# EAGLE design dsky_md_4.0v (EAGLE 6.5.0)
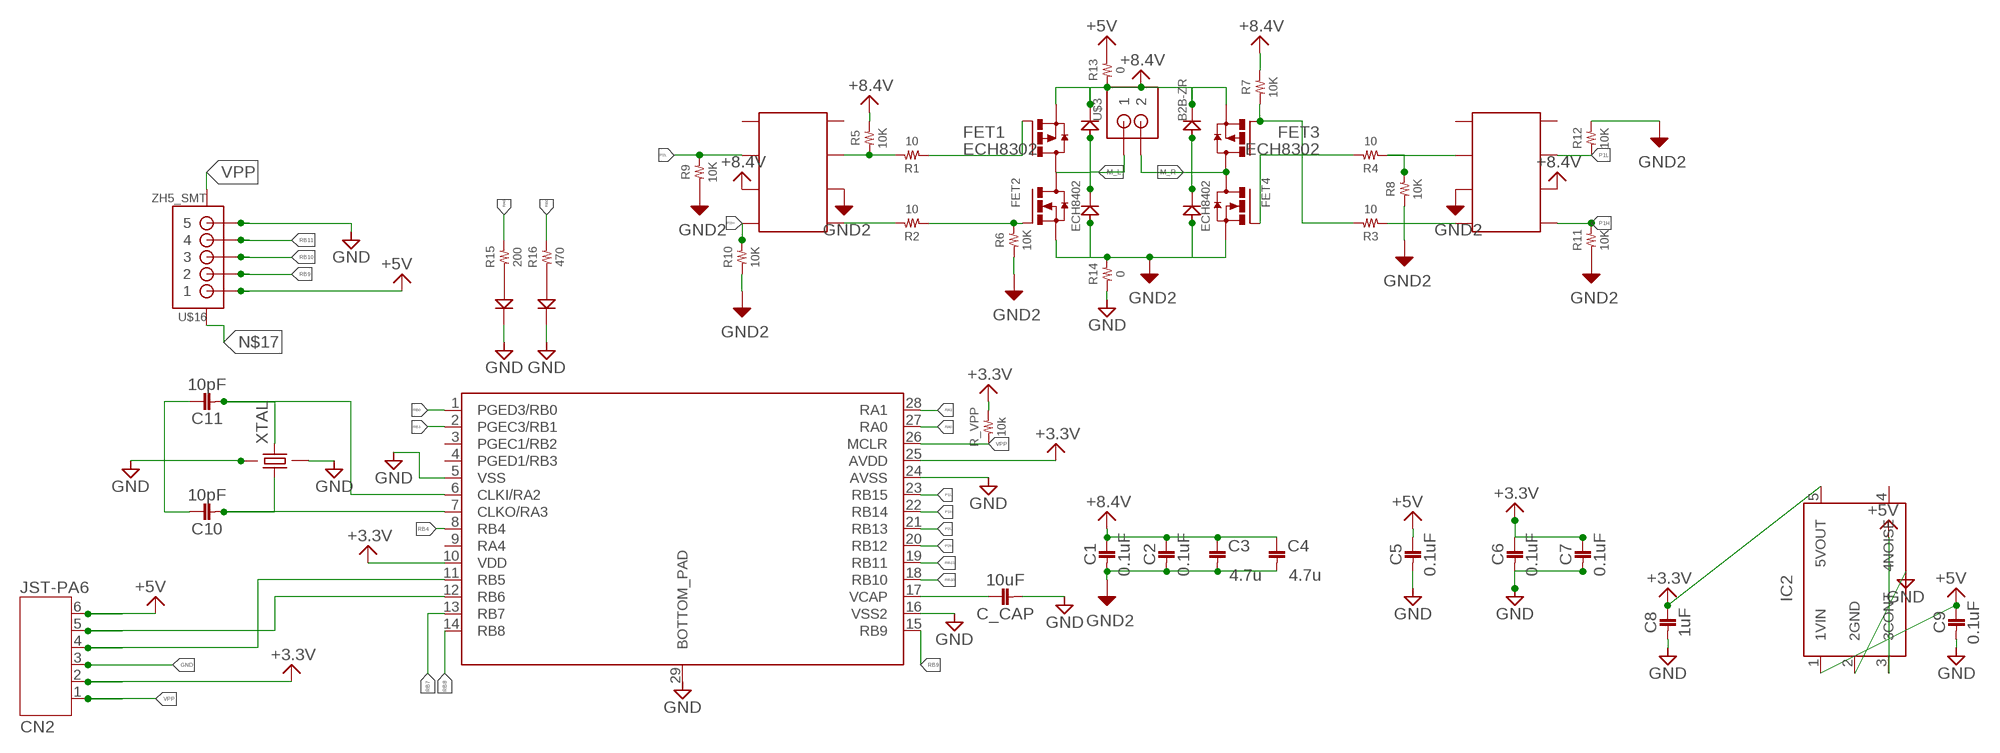
[diagram p0: schematic, sheet 1]

## Parts
C1  0.1uF  1608  [1608]
C2  0.1uF  1608  [1608]
C3  4.7u  2012  [2012]
C4  4.7u  2012  [2012]
C5  0.1uF  1608  [1608]
C6  0.1uF  1608  [1608]
C7  0.1uF  1608  [1608]
C8  1uF  1608  [1608]
C9  0.1uF  1608  [1608]
C10  10pF  1608  [1608]
C11  10pF  1608  [1608]
C_CAP  10uF  1608  [1608]
CN2  JST-PA6  [JST-PA6]
D1  SS2040  [SOD-123FL]
D2  SS2040  [SOD-123FL]
D3  SS2040  [SOD-123FL]
D4  SS2040  [SOD-123FL]
FET1  ECH8302  ECH83  [ECH8]
FET2  ECH8402  ECH84  [ECH8]
FET3  ECH8302  ECH83  [ECH8]
FET4  ECH8402  ECH84  [ECH8]
IC1  DSPIC33EP32MC202  [QFN-S28_6X6MC]
IC2  NJM2866F33  TAR5SB  [SSOP5-P-0.95]
IC3  TC1427COA  [SOIC8]
IC4  TC1427COA  [SOIC8]
LED1  1608  [1608]
LED2  1608  [1608]
R1  10  RESISTOR__SMD  [1608]
R2  10  RESISTOR__SMD  [1608]
R3  10  RESISTOR__SMD  [1608]
R4  10  RESISTOR__SMD  [1608]
R5  10K  RESISTOR__SMD  [1608]
R6  10K  RESISTOR__SMD  [1608]
R7  10K  RESISTOR__SMD  [1608]
R8  10K  RESISTOR__SMD  [1608]
R9  10K  RESISTOR__SMD  [1608]
R10  10K  RESISTOR__SMD  [1608]
R11  10K  RESISTOR__SMD  [1608]
R12  10K  RESISTOR__SMD  [1608]
R13  0  RESISTOR__SMD  [1608]
R14  0  RESISTOR__SMD  [1608]
R15  200  RESISTOR__SMD  [1608]
R16  470  RESISTOR__SMD  [1608]
R_VPP  10k  RESISTOR__SMD  [1608]
U$3  B2B-ZR  [B2B-ZR]
U$16  ZH5_SMT  [ZH5_SMT]
XTAL  X22  [SMD_X22]

## Nets
+3.3V: C6.P$1 C7.P$1 C8.P$1 CN2.2 IC1.10(VDD) IC1.25(AVDD) IC2.5(5VOUT) R_VPP.2
+5V: C5.P$1 C9.P$1 CN2.6 IC2.1(1VIN) IC2.3(3CONT) R13.2 U$16.P1
+8.4V: C1.P$1 C2.P$1 C3.1 C4.1 D1.2(PK) D3.2(PK) FET1.1(S) FET1.2(S) FET1.3(S) FET3.1(S) FET3.2(S) FET3.3(S) IC3.3(3_GND) IC4.3(3_GND) R5.2 R7.2 R13.1
GND: C5.P$2 C6.P$2 C7.P$2 C8.P$2 C9.P$2 C10.P$1 C11.P$1 C_CAP.P$2 CN2.3 IC1.5(VSS) IC1.16(VSS2) IC1.24(AVSS) IC1.29(BOTTOM_PAD) IC2.2(2GND) LED1.2(K) LED2.2(K) R14.1 U$16.P5 XTAL.2 XTAL.4
GND2: C1.P$2 C2.P$2 C3.2 C4.2 D2.1(PA) D4.1(PA) FET2.1(S) FET2.2(S) FET2.3(S) FET4.1(S) FET4.2(S) FET4.3(S) IC3.6(6_VDD) IC4.6(6_VDD) R6.1 R8.1 R9.1 R10.1 R11.1 R12.2 R14.2
M_L: D1.1(PA) D2.2(PK) FET1.5(D) FET1.6(D) FET1.7(D) FET1.8(D) FET2.5(D) FET2.6(D) FET2.7(D) FET2.8(D) U$3.1
M_R: D3.1(PA) D4.2(PK) FET3.5(D) FET3.6(D) FET3.7(D) FET3.8(D) FET4.5(D) FET4.6(D) FET4.7(D) FET4.8(D) U$3.2
N$1: FET1.4(G) R1.1
N$2: FET2.4(G) R2.1 R6.2
N$3: IC3.7(7_OUT_A) R1.2 R5.1
N$4: FET3.4(G) R3.2 R7.1
N$5: IC3.5(5_OUT_B) R2.2
N$6: IC4.7(7_OUT_A) R4.1 R8.2
N$7: C_CAP.P$1 IC1.17(VCAP)
N$8: C10.P$2 IC1.7(CLKO/RA3) XTAL.1
N$9: IC4.5(5_OUT_B) R3.1
N$10: CN2.4 IC1.11(RB5)
N$11: CN2.5 IC1.12(RB6)
N$12: FET4.4(G) R4.2
N$13: C11.P$2 IC1.6(CLKI/RA2) XTAL.3
N$14: LED1.1(A) R15.1
N$16: LED2.1(A) R16.1
N$17: U$16.G1(G_L)
P1H: IC1.22(RB14) IC4.4(4_IN_B) R11.2
P1L: IC1.23(RB15) IC4.2(2_IN_A) R12.1
P2H: IC1.20(RB12) IC3.4(4_IN_B) R10.2
P2L: IC1.21(RB13) IC3.2(2_IN_A) R9.2
RA0: IC1.27(RA0) R15.2
RA1: IC1.28(RA1)
RB0: IC1.1(PGED3/RB0) R16.2
RB1: IC1.2(PGEC3/RB1)
RB4: IC1.8(RB4)
RB7: IC1.13(RB7)
RB8: IC1.14(RB8)
RB9: IC1.15(RB9) U$16.P2
RB10: IC1.18(RB10) U$16.P3
RB11: IC1.19(RB11) U$16.P4
VPP: CN2.1 IC1.26(MCLR) R_VPP.1 U$16.G2(G_R)
Unconnected: IC1.3(PGEC1/RB2) IC1.4(PGED1/RB3) IC1.9(RA4) IC2.4(4NOISE) IC3.1(1_NC) IC3.8(8_NC) IC4.1(1_NC) IC4.8(8_NC)

## Library data of the parts
C1 C2 C5-C11 C_CAP = 02_C:1608
C3 C4 = 02_C:2012
CN2 = jst-ph:JST-PA6
D1-D4 = DIODE:SS2040
FET1 FET3 = 06_FET:ECH83
FET2 FET4 = 06_FET:ECH84
IC1 = microchip-dspic:DSPIC33EP32MC202
IC2 = 04_IC:TAR5SB
IC3 IC4 = 04_IC:TC1427COA
LED1 LED2 = 10_LED:1608
R1-R16 R_VPP = 01_R:RESISTOR__SMD
U$3 = jst:B2B-ZR
U$16 = 14_JST:ZH5_SMT
XTAL = 09_2_CRYSTAL:X22

## Board
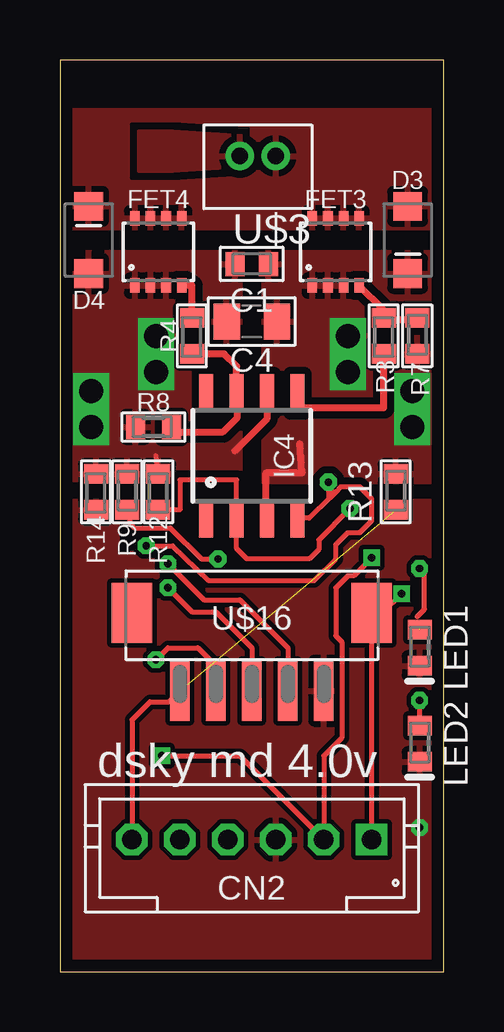
[diagram p1: board, top side]
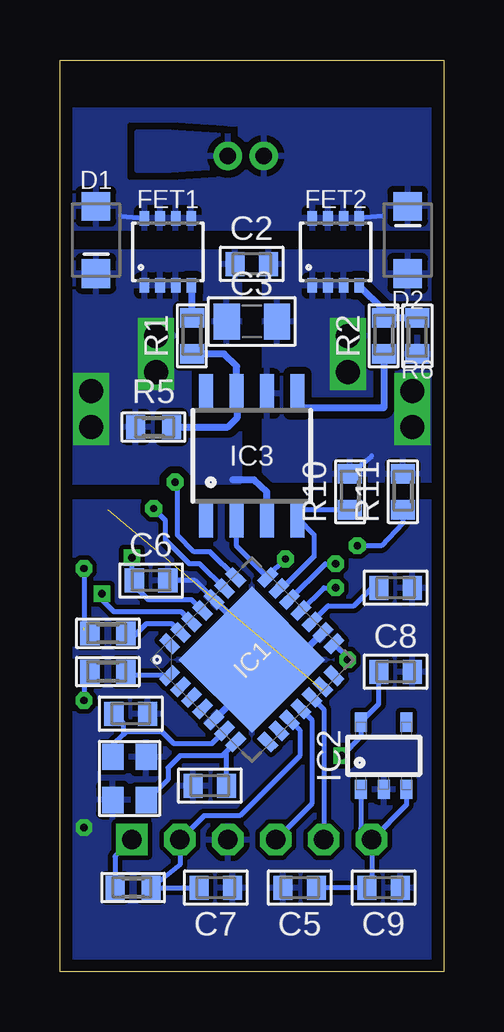
[diagram p2: board, bottom side, seen from below]

Size 16 x 38 mm. Coordinates in mm from the lower left corner, seen from the top.
Outline: 0,0 16,0 16,38 0,38 0,0
Copper layers (1*16): Top 0.035mm / dielectric 1.5mm / Bottom 0.035mm
Design rules "default *": minimum track width 6mil, minimum drill 12mil, track to track 6mil, track to pad 6mil, pad to pad 6mil, via to via 6mil, smd to smd 8mil, copper to edge 20mil, drill to drill 8mil, minimum pad ring 10mil, minimum via ring 8mil, stop-mask expansion 4mil, vias tented up to drill 0.4mm, thermal gap 10mil
bKeepout: area 0,0 to 16,2; area 0,36 to 16,38

### Footprints (pad centres in the part's own frame; a part is rotated, then mirrored left to right if it is on the bottom)
1608 = smd 0.8 x 1: P$1 -0.7,0; P$2 0.7,0
2012 = smd 1.1 x 1.5: 1 -1.05,0; 2 1.05,0
JST-PA6 = drill 0.8 square: 1 5,0 | drill 0.8 octagon: 2 3,0; 3 1,0; 4 -1,0; 5 -3,0; 6 -5,0
SOD-123FL = smd 1.2 x 1.2: 1 -1.4,0; 2 1.4,0
ECH8 = smd 0.4 x 0.6: 1 -0.975,-1.4; 2 -0.325,-1.4; 3 0.325,-1.4; 4 0.975,-1.4; 5 0.975,1.4; 6 0.325,1.4; 7 -0.325,1.4; 8 -0.975,1.4
QFN-S28_6X6MC = smd 0.813 x 0.432: 1 -2.896,1.956; 2 -2.896,1.295; 3 -2.896,0.66; 4 -2.896,0; 5 -2.896,-0.66; 6 -2.896,-1.295; 7 -2.896,-1.956; 15 2.896,-1.956; 16 2.896,-1.295; 17 2.896,-0.66; 18 2.896,0; 19 2.896,0.66; 20 2.896,1.295; 21 2.896,1.956 | smd 0.432 x 0.813: 8 -1.956,-2.896; 9 -1.295,-2.896; 10 -0.66,-2.896; 11 0,-2.896; 12 0.66,-2.896; 13 1.295,-2.896; 14 1.956,-2.896; 22 1.956,2.896; 23 1.295,2.896; 24 0.66,2.896; 25 0,2.896; 26 -0.66,2.896; 27 -1.295,2.896; 28 -1.956,2.896 | smd 4.318 x 4.318: 29 0,0
SSOP5-P-0.95 = smd 0.5 x 0.8: 1 -0.95,-1.4; 2 0,-1.4; 3 0.95,-1.4; 4 0.95,1.4; 5 -0.95,1.4
SOIC8 = smd 0.6 x 1.6: 1 -1.905,-2.6; 2 -0.635,-2.6; 3 0.635,-2.6; 4 1.905,-2.6; 5 1.905,2.6; 6 0.635,2.6; 7 -0.635,2.6; 8 -1.905,2.6
1608' = smd 0.8 x 1: 1 -0.75,0; 2 0.75,0
B2B-ZR = drill 0.7 pad 1.1: 1 -1.5,0; 2 0,0
ZH5_SMT = smd 1.7 x 2.5: G1 -5,1.95; G2 5,1.95 | smd 0.8 x 2.5: P1 -3,-1.3; P2 -1.5,-1.3; P3 0,-1.3; P4 1.5,-1.3; P5 3,-1.3
SMD_X22 = smd 1.1 x 0.9: 1 -0.9,-0.7; 2 0.9,-0.7; 3 0.9,0.7; 4 -0.9,0.7

### Placement (x,y rotation side)
C1  8,29.5 180 top
C2  8,29.5 0 bottom
C3  8,27.1 0 bottom
C4  8,27.1 180 top
C5  6,3.5 180 bottom
C6  12.2,16.3 0 bottom
C7  9.5,3.5 0 bottom
C8  2,12.5 0 bottom
C9  2.5,3.5 0 bottom
C10  9.75,7.75 0 bottom
C11  13.05,10.75 180 bottom
C_CAP  2,16 0 bottom
CN2  8,5.5 0 top
D1  14.5,30.5 270 bottom
D2  1.5,30.5 90 bottom
D3  14.5,30.5 270 top
D4  1.2,30.5 90 top
FET1  11.5,30 0 bottom
FET2  4.5,30 0 bottom
FET3  11.5,30 0 top
FET4  4.1,30 0 top
IC1  8,13 45 bottom
IC2  2.5,9 0 bottom
IC3  8,21.5 0 bottom
IC4  8,21.5 0 top
LED1  1608  [1608']  15,13.5 270 top
LED2  1608  [1608']  15,9.5 270 top
R1  10  [1608']  10.5,26.5 270 bottom
R2  10  [1608']  2.5,26.5 270 bottom
R3  10  [1608']  13.5,26.5 90 top
R4  10  [1608']  5.5,26.5 90 top
R5  10K  [1608']  12.1,22.7 180 bottom
R6  10K  [1608']  1.1,26.5 90 bottom
R7  10K  [1608']  14.9,26.5 270 top
R8  10K  [1608']  3.9,22.7 0 top
R9  10K  [1608']  2.8,20 270 top
R10  10K  [1608']  3.9,20 270 bottom
R11  10K  [1608']  1.7,20 270 bottom
R12  10K  [1608']  4.1,20 90 top
R13  0  [1608']  14,20 270 top
R14  0  [1608']  1.5,20 90 top
R15  200  [1608']  14,14.1 0 bottom
R16  470  [1608']  14,12.5 0 bottom
R_VPP  10k  [1608']  12.95,3.5 0 bottom
U$3  9,34 0 top
U$16  8,13 0 top
XTAL  13.1,8.05 90 bottom

### Tracks (layer width: path | path; a pad name or v marks a point on that pad's centre or on a via)
+3.3V  (via drill 0.3)
  Top 0.2: v4.25,9 7.5,9 CN2.2 11,9 11.75,9.75 11.75,13.75 11.5,14 11.5,16 12,16.5 12.25,16.5 v13,17.25
  Bottom 0.2: IC1.25 10.5,15.5 12.3,15.5 12.9,16.1 | IC1.10 6,10.07 6,9 8.5,6.5 10,6.5 CN2.2 11,4.45 R_VPP.2 C7.P$1 | v4.25,9 3.45,9.8 IC2.5 2.7,11.15 C8.P$1 | 12.9,16.1 C6.P$1 | 12.9,16.1 13,16.2 v13,17.25
+5V  (1 unrouted)
  Top 0.2: 5,10.75 U$16.P1 4.55,11.25 3.75,11.25 3,10.5 CN2.6
  Bottom 0.2: IC2.3 1.55,6.95 CN2.6 | IC2.1 3.45,5.95 CN2.6 | CN2.6 3,3.7 C9.P$1 C5.P$1
+8.4V  (via drill 1)
  Top 0.3: IC4.3 8.6,18.9 8.6,20.8 10.1,20.8 10,22
  Bottom 0.3: IC3.3 7.37,20 7.9,20.5 8.8,20.5
  other vias: 12,26.5 12,25 14.7,22.7 14.7,24.2
  pour Bottom (isolate 0.3): 8.5,30 16,30 16,20.4 8.5,20.4
  pour Top (isolate 0.3): 8.5,30 16,30 16,20.4 8.5,20.4
GND  (via drill 0.3)
  Bottom 0.2: IC1.24 10.37,16.3 C6.P$2
  Bottom 0.3: IC1.5 8,12.07 IC1.29 | IC1.24 8,13.93 IC1.29 | IC1.16 6.17,13 IC1.29
  other vias: 15,6
  pour Top (isolate 0.2): 0,0 16,0 16,19.6 3,19.6 3,17.3 2.4,17.3 2.4,19.6 0,19.6
  pour Bottom (isolate 0.2): 0,0 16,0 16,19.6 0,19.6
GND2  (via drill 1)
  Top 0.2: R12.2 4,21.5
  Top 0.3: IC4.6 8.63,23.04 7.3,21.7
  Bottom 0.2: R10.1 3,21.5
  other vias: 4,26.5 4,25 1.3,22.7 1.3,24.2
  pour Bottom (isolate 0.3): 0,30 7.5,30 7.5,20.5 0,20.5
  pour Top (isolate 0.3): 0,30 7.5,30 7.5,20.5 0,20.5
M_L
  Bottom 0.2: 2.52,31.5 FET2.5 | 13.47,31.5 FET1.8
  pour Bottom (isolate 0.3, rank 2): 0,35.9 16,35.9 16,31 0,31
  pour Top: 3.3,35 3.3,33.4 4.7,33.4 7.6,33.6 7.6,34.8 4.7,35
M_R
  pour Top (isolate 0.3, rank 2): 0,35.9 16,35.9 16,31 0,31
  pour Bottom: 8.5,34.8 11.4,35 12.8,35 12.8,33.4 11.4,33.4 8.5,33.6
N$1
  Bottom 0.2: 10.5,28.57 FET1.4
  Bottom 0.3: R1.1 10.5,28.57
N$2
  Bottom 0.3: R6.2 R2.1 2.5,27.57 FET2.4
N$3
  Bottom 0.3: R1.2 9.15,25.75 8.63,25.23 IC3.7 8.6,24.07 8.6,23.1 9,22.7 R5.1
N$4
  Top 0.3: R7.1 14.9,27.15 14,27.15 R3.2 13.5,27.57 FET3.4
N$5
  Bottom 0.3: R2.2 2.5,23.5 6,23.5 6,24.1 IC3.5
N$6
  Top 0.3: R4.1 6.85,25.75 7.37,25.23 IC4.7 7.4,24.07 7.4,23.1 6.8,22.5 4.7,22.5 R8.2
N$7
  Bottom 0.2: IC1.17 4.82,15.25 3.75,15.25 3,16 C_CAP.P$1
N$8
  Bottom 0.2: XTAL.1 12.35,7.15 11.5,8 11.5,8.5 11,9 9.23,9 IC1.7 9.05,9.18 C10.P$2
N$9
  Top 0.3: IC4.5 9.9,23.59 10,23.5 13.5,23.5 R3.1
N$10
  Bottom 0.2: IC1.11 5.5,10.5 5.5,7 CN2.4
N$11
  Bottom 0.2: IC1.12 5,10.93 CN2.5
N$12
  Top 0.3: R4.2 5.5,28.6 FET4.4
N$13
  Bottom 0.2: IC1.6 9.67,9.5 11.25,9.5 11.75,10 13.25,10 13.38,9.88 | 13.38,9.88 13.8,9.45 XTAL.3 | C11.P$2 13.38,10.38 13.38,9.88
N$14  (via drill 0.3)  (1 unrouted)
  Top 0.2: 14.9,14.8 15.2,15.1 15.2,16.6 v15,16.8
  Bottom 0.2: v15,16.8 15,14.35 R15.1
N$16  (via drill 0.3)
  Top 0.2: 15,10.85 v15,11.3 LED2.1
  Bottom 0.2: R16.1 15,12.25 v15,11.3
P1H  (via drill 0.3)
  Top 0.2: v3.6,17.75 4.7,17.75 6.2,16.3 10.6,16.3 11.5,17.2 11.5,17.8 12,18.3 12.5,18.3 13,18.8 13,19.7 12.5,20.2 11.7,20.2 11.5,20 | 11.5,20 11.25,19.75 | 11.25,19.75 10.4,18.9 IC4.4 | 11.4,20 11.5,20 | v11.2,20.4 11.2,19.8 arc90 11.25,19.75
  Bottom 0.2: R11.2 1.7,18.7 2.6,17.75 v3.6,17.75 | IC1.22 9.73,17.5 10.4,17.5 11.1,18.2 11.1,20.4 v11.2,20.4
P1L  (via drill 0.3)
  Top 0.2: R12.1 5,19.25 5,20.5 7.37,20.5 IC4.2 7.37,17.64 7.8,17.2 10.4,17.2 10.8,17.6 10.8,18 v12.1,19.3
  Bottom 0.2: IC1.23 10.17,17 10.6,17 11.6,18 11.6,18.8 v12.1,19.3
P2H
  Bottom 0.2: R10.2 5.75,19.25 arc-90 IC3.4 5.4,18.2 5.4,17.3 6.74,15.96 IC1.20
P2L  (via drill 0.3)
  Top 0.2: R9.2 2.9,19.15 2.9,18.7 3.1,18.5 4.6,18.5 5.9,17.2 v6.6,17.2
  Bottom 0.2: IC3.2 8.63,17.73 IC1.21 7.33,16.46 v6.6,17.2
RA0
  Bottom 0.2: IC1.27 11.33,14.5 12.4,14.5 12.9,14 R15.2
RB0
  Bottom 0.2: IC1.1 13.25,12.34 R16.2
RB9  (via drill 0.3)
  Top 0.2: v4,13 4.5,13.5 5.75,13.5 6.5,12.75 U$16.P2
  Bottom 0.2: IC1.15 4,13.1 v4,13
RB10  (via drill 0.3)
  Top 0.2: v4.5,16 5.5,15 6.5,15 8,13.5 U$16.P3
  Bottom 0.2: IC1.18 5,16 v4.5,16
RB11  (via drill 0.3)
  Top 0.2: v4.5,17 6,15.5 7.5,15.5 9.5,13.5 U$16.P4
  Bottom 0.2: IC1.19 4.93,17 v4.5,17
VPP  (via drill 0.3)
  Top 0.2: CN2.1 U$16.G2 13.45,14.95 v14.25,15.75
  Bottom 0.2: IC1.26 10.93,15 13.75,15 14.25,15.5 v14.25,15.75 | CN2.1 13.7,4.8 R_VPP.1

### Text on the board
tPlace: dsky md 4.0v